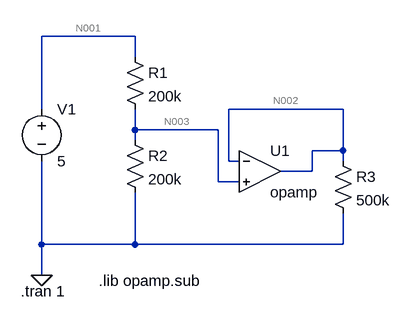
[diagram p0: schematic T4_5_opamp.asc]
T4_5_opamp.asc, the LTspice schematic file:
Version 4
SHEET 1 880 680
WIRE 240 16 96 16
WIRE 240 48 240 16
WIRE 96 128 96 16
WIRE 560 128 384 128
WIRE 240 160 240 128
WIRE 368 160 240 160
WIRE 240 176 240 160
WIRE 560 192 560 128
WIRE 560 192 512 192
WIRE 384 208 384 128
WIRE 400 208 384 208
WIRE 560 208 560 192
WIRE 512 224 512 192
WIRE 512 224 464 224
WIRE 368 240 368 160
WIRE 400 240 368 240
WIRE 96 336 96 208
WIRE 240 336 240 256
WIRE 240 336 96 336
WIRE 560 336 560 288
WIRE 560 336 240 336
WIRE 96 384 96 336
FLAG 96 384 0
SYMBOL voltage 96 112 R0
WINDOW 123 0 0 Left 0
WINDOW 39 0 0 Left 0
SYMATTR InstName V1
SYMATTR Value 5
SYMBOL res 224 32 R0
SYMATTR InstName R1
SYMATTR Value 200k
SYMBOL res 224 160 R0
SYMATTR InstName R2
SYMATTR Value 200k
SYMBOL res 544 192 R0
SYMATTR InstName R3
SYMATTR Value 500k
SYMBOL OpAmps\\opamp 432 160 R0
SYMATTR InstName U1
TEXT 64 408 Left 2 !.tran 1
TEXT 184 392 Left 2 !.lib opamp.sub

The netlist it stands for:
* T4_5_opamp.asc
V1 N001 0 5
R1 N001 N003 200k
R2 N003 0 200k
R3 N002 0 500k
XU1 N002 N003 N002 opamp Aol=100K GBW=10Meg  ; pins invin noninvin out
.tran 1
.lib opamp.sub
.backanno
.end

* Results of the author's LTspice run, read from the files saved beside the schematic
* Operating Point, zero values left out:
*   V(n001) = 5 V
*   V(n003) = 2.5 V
*   V(n002) = 2.5 V
*   I(R3) = 5 µA
*   I(R2) = 2.5 nA
*   I(R1) = 2.5 nA
*   I(V1) = -2.5 nA
*   Ix(u1:3) = -5 µA